# EAGLE design kafka (EAGLE 9.4.1)
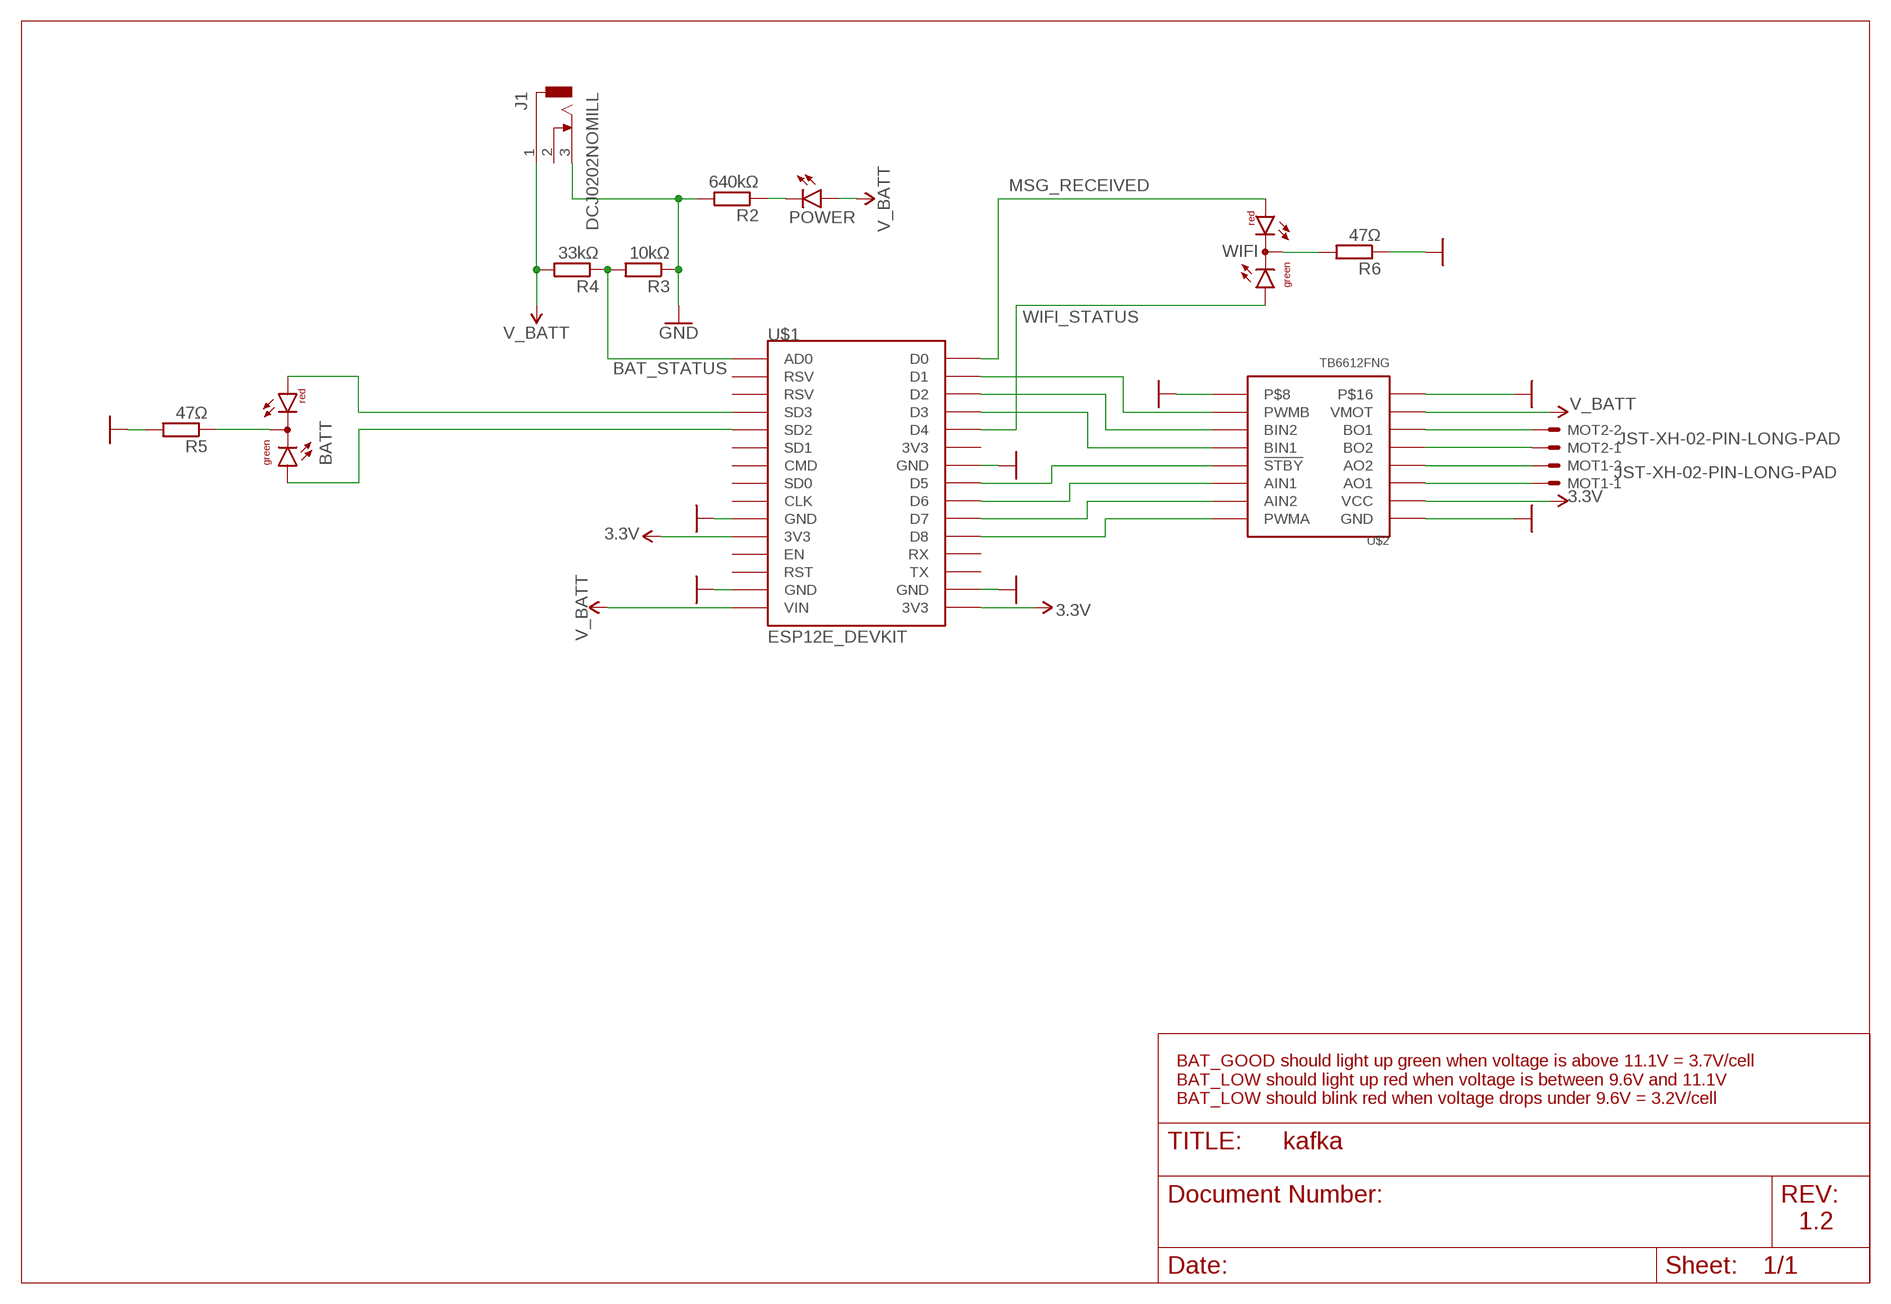
[diagram p0: schematic, sheet 1]

## Parts
BATT  DUOLED-RG-C3MM  [DUOLED-A-3MM]
J1  DCJ0202NOMILL  [DCJ0202_NOMILL]
MOT1  JST-XH-02-PIN-LONG-PAD  [JST-XH-02-PACKAGE-LONG-PAD]
MOT2  JST-XH-02-PIN-LONG-PAD  [JST-XH-02-PACKAGE-LONG-PAD]
POWER  LED3MM  [LED3MM]
R2  640kΩ  R-EU_R0603  [R0603]
R3  10kΩ  R-EU_R0603  [R0603]
R4  33kΩ  R-EU_R0603  [R0603]
R5  47Ω  R-EU_R0603  [R0603]
R6  47Ω  R-EU_R0603  [R0603]
U$1  ESP12E_DEVKIT  [ESP12E_DEVKIT]
U$2  TB6612FNG  [TB6612FNG]
WIFI  DUOLED-RG-C3MM  [DUOLED-A-3MM]

## Nets
3.3V: U$1.3V3@2(3V3) U$2.VCC
AIN1: U$1.D6 U$2.AIN1
AIN2: U$1.D7 U$2.AIN2
BAT_STATUS: R3.2 R4.1 U$1.AD0
BIN1: U$1.D3 U$2.BIN1
BIN2: U$1.D2 U$2.BIN2
GND: J1.3 R2.2 R3.1 R5.2 R6.1 U$1.GND@0(GND) U$1.GND@1(GND) U$1.GND@2(GND) U$1.GND@3(GND) U$2.GND U$2.TB6612FNG1 U$2.TB6612FNG2
MSG_RECEIVED: U$1.D0 WIFI.3(AR)
N$1: MOT2.2 U$2.BO1
N$2: MOT2.1 U$2.BO2
N$3: MOT1.2 U$2.AO2
N$4: MOT1.1 U$2.AO1
N$5: R6.2 WIFI.2(C)
N$11: POWER.K(C) R2.1
N$16: BATT.1(AG) U$1.SD2
N$17: BATT.3(AR) U$1.SD3
N$18: BATT.2(C) R5.1
N$19: U$1.3V3@0(3V3) ; supply symbol labelled 3.3V
PWMA: U$1.D8 U$2.PWMA
PWMB: U$1.D1 U$2.PWMB
STBY: U$1.D5 U$2.!STBY
V_BATT: J1.1 POWER.A R4.2 U$1.VIN U$2.VMOT
WIFI_STATUS: U$1.D4 WIFI.1(AG)
Unconnected: J1.2 U$1.3V3@1(3V3) U$1.CLK U$1.CMD U$1.EN U$1.RST U$1.RSV@0(RSV) U$1.RSV@1(RSV) U$1.RX U$1.SD0 U$1.SD1 U$1.TX

## Notes on the sheet
- BAT_GOOD should light up green when voltage is above 11.1V = 3.7V/cell
  BAT_LOW should light up red when voltage is between 9.6V and 11.1V
  BAT_LOW should blink red when voltage drops under 9.6V = 3.2V/cell
- 1.2

## Library data of the parts
BATT WIFI = led2:DUOLED-RG-C: DUO LED 2 colors (red/green), 5 mm, round, common Cathode www.ligitek.com or other producers.
J1 = con-jack:DCJ0202: DC POWER JACK Source: DCJ0202.pdf
MOT1 MOT2 = Rembrandt Electronics - JST XH Connectors v1-0:JST-XH-02-PIN: JST XH Connector 2 Pin Wire to board connector. Pitch: 2,54 mm, (0.100") Number of pins: 2 Created by Rembrandt Electronics www.rembrandtelectronics.com
POWER = led:LED: LED OSRAM: - CHIPLED LG R971, LG N971, LY N971, LG Q971, LY Q971, LO R971, LY R971 LH N974, LH R974 LS Q976, LO Q976, LY Q976 LO Q996 - Hyper CHIPLED LW Q18S LB Q993, LB Q99A, LB R99A - SideLED LS A670, LO A670, LY A670, LG A670, LP A670 LB A673, LV A673, LT A673, LW A673 LH A674 LY A675 LS A676, LA A676, LO A676, LY A676, LW A676 LS A679, LY A679, LG A679 - Hyper Micro SIDELED® LS Y876, LA Y876, LO Y876, LY Y876 LT Y87S - SmartLED LW L88C, LW L88S LB L89C, LB L89S, LG L890 LS L89K, LO L89K, LY L89K LS L896, LA L896, LO L896, LY L896 - TOPLED LS T670, LO T670, LY T670, LG T670, LP T670 LSG T670, LSP T670, LSY T670, LOP T670, LYG T670 LG T671, LOG T671, LSG T671 LB T673, LV T673, LT T673, LW T673 LH T674 LS T676, LA T676, LO T676, LY T676, LB T676, LH T676, LSB T676, LW T676 LB T67C, LV T67C, LT T67C, LS T67K, LO T67K, LY T67K, LW E67C LS E67B, LA E67B, LO E67B, LY E67B, LB E67C, LV E67C, LT E67C LW T67C LS T679, LY T679, LG T679 LS T770, LO T770, LY T770, LG T770, LP T770 LB T773, LV T773, LT T773, LW T773 LH T774 LS E675, LA E675, LY E675, LS T675 LS T776, LA T776, LO T776, LY T776, LB T776 LHGB T686 LT T68C, LB T68C - Hyper Mini TOPLED® LB M676 - Mini TOPLED Santana® LG M470 LS M47K, LO M47K, LY M47K Source: http://www.osram.convergy.de LUXEON: - LUMILED® LXK2-PW12-R00, LXK2-PW12-S00, LXK2-PW14-U00, LXK2-PW14-V00 LXK2-PM12-R00, LXK2-PM12-S00, LXK2-PM14-U00 LXK2-PE12-Q00, LXK2-PE12-R00, LXK2-PE12-S00, LXK2-PE14-T00, LXK2-PE14-U00 LXK2-PB12-K00, LXK2-PB12-L00, LXK2-PB12-M00, LXK2-PB14-N00, LXK2-PB14-P00, LXK2-PB14-Q00 LXK2-PR12-L00, LXK2-PR12-M00, LXK2-PR14-Q00, LXK2-PR14-R00 LXK2-PD12-Q00, LXK2-PD12-R00, LXK2-PD12-S00 LXK2-PH12-R00, LXK2-PH12-S00 LXK2-PL12-P00, LXK2-PL12-Q00, LXK2-PL12-R00 Source: www.luxeon.com KINGBRIGHT: KA-3528ASYC Source: www.kingbright.com
R2-R6 = rcl:R-EU_: RESISTOR, European symbol; SPICEPREFIX: R
U$1 = ESP12E_DEVKIT:ESP12E_DEVKIT: ESP12E DEVKIT BOARD
U$2 = Pololu_JJ:TB6612FNG: Pololu TB6612FNG Dual Motor Driver Carrier https://www.pololu.com/product/713

## Board
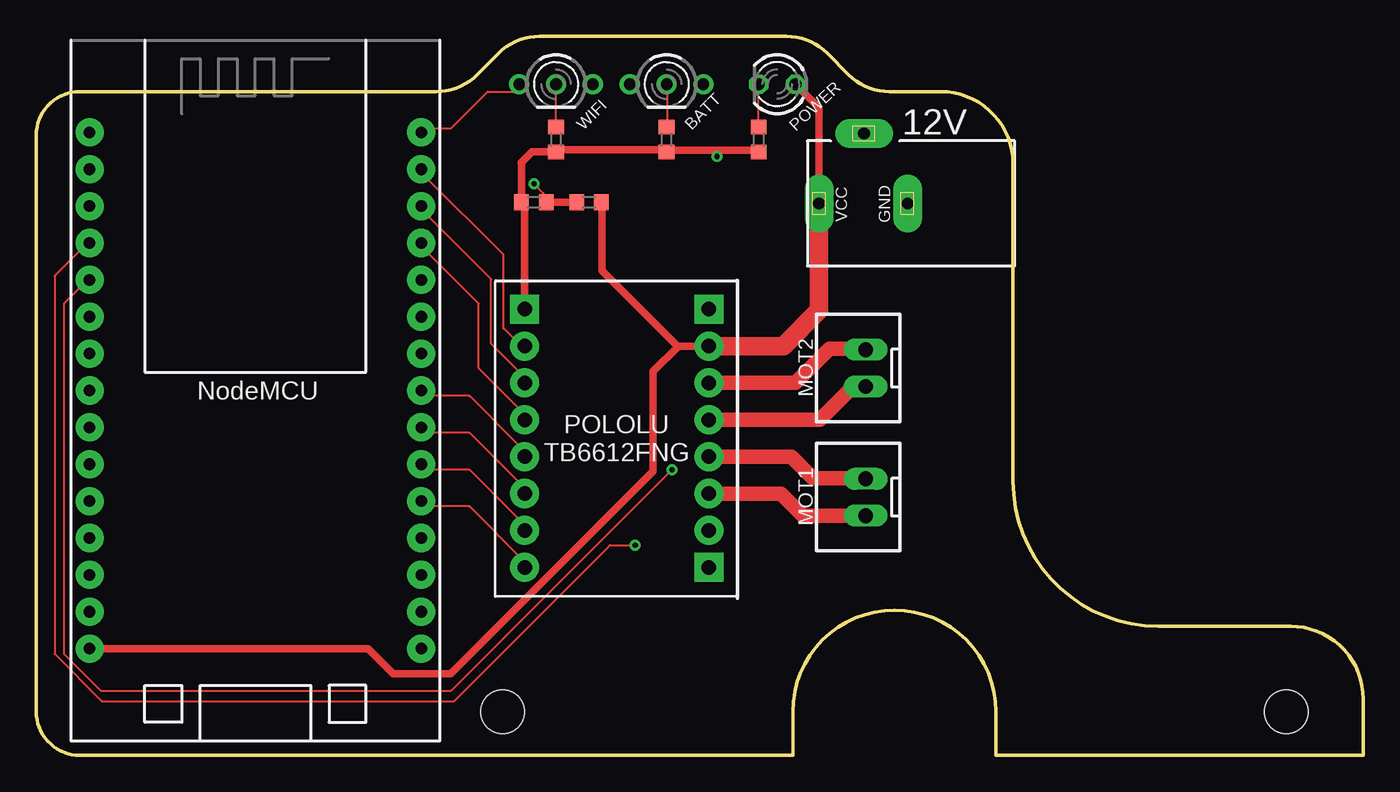
[diagram p1: board, top side]
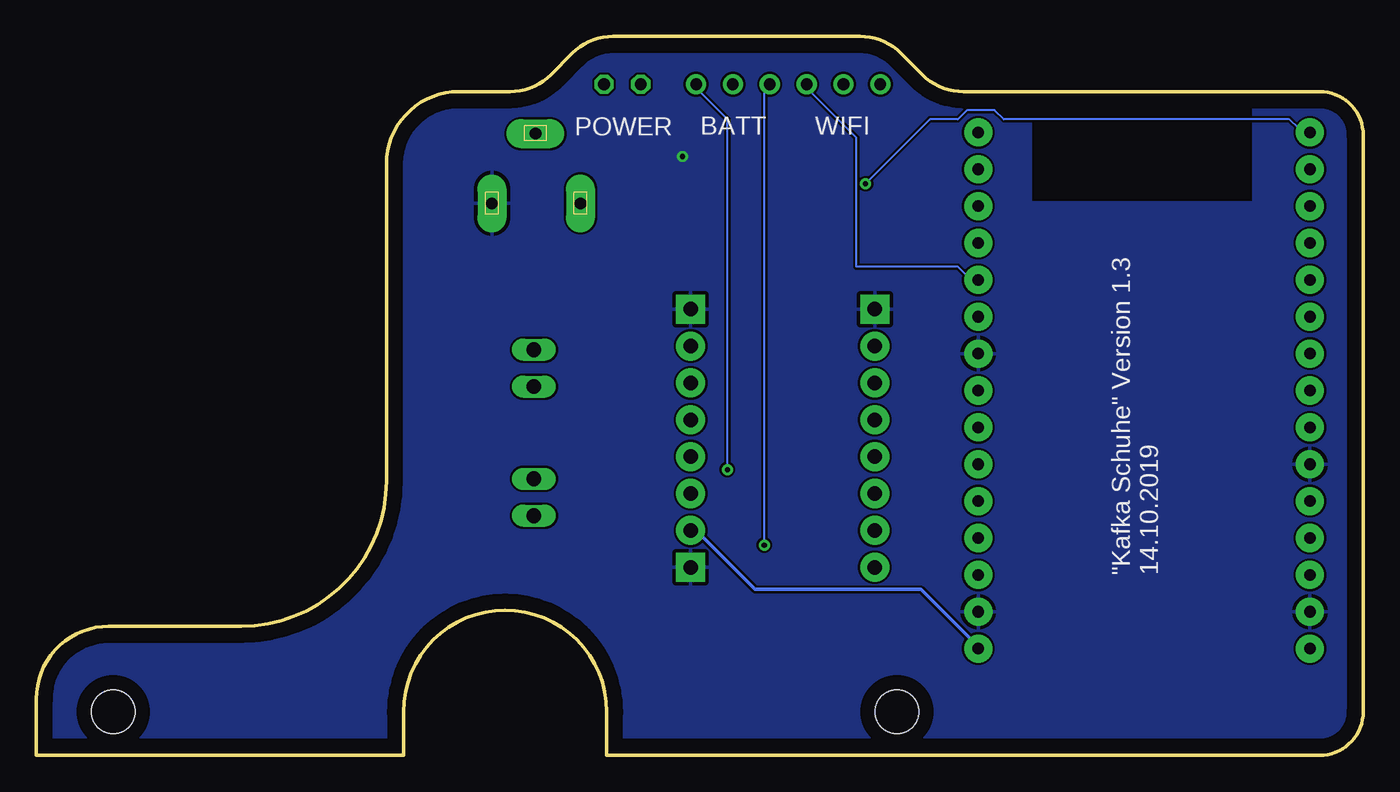
[diagram p2: board, bottom side, seen from below]

Size 91.44 x 49.53 mm. Coordinates in mm from the lower left corner, seen from the top.
Outline: 67.31,18.89 67.31,40.72 arc90 62.31,45.72 58.81,45.72 arc-45 55.98,46.89 54.51,48.36 arc45 51.68,49.53 34.68,49.53 arc45 31.85,48.36 30.38,46.89 arc-45 27.55,45.72 3,45.72 arc90 0,42.72 0,3 arc90 3,0 52.13,0 52.13,3 arc-180 66.13,3 66.13,0 91.44,0 91.44,3.89 arc90 86.44,8.89 77.31,8.89 arc-90 67.31,18.89
Copper layers (1*16): Top 0.035mm / dielectric 1.5mm / Bottom 0.035mm
Design rules "default": minimum track width 6mil, minimum drill 0.35mm, track to track 6mil, track to pad 6mil, pad to pad 6mil, via to via 6mil, smd to smd 6mil, copper to edge 40mil, drill to drill 6mil, minimum pad ring 10mil, minimum via ring 8mil, stop-mask expansion 4mil, vias tented up to drill 0mil, thermal gap 10mil
Holes 3 mm at 86.13,3 32.13,3

### Footprints (pad centres in the part's own frame; a part is rotated, then mirrored left to right if it is on the bottom)
DUOLED-A-3MM = drill 0.8 pad 1.4: 1 -2.54,0; 2 0,0; 3 2.54,0
DCJ0202_NOMILL = drill 0.8 pad 2 long: 1 0,3.1; 2 4.8,0; 3 0,-3
JST-XH-02-PACKAGE-LONG-PAD = drill 1.016 long: 1 -1.27,0; 2 1.27,0
LED3MM = drill 0.813 octagon: A -1.27,0; K 1.27,0
R0603 = smd 1 x 1.1: 1 -0.85,0; 2 0.85,0
ESP12E_DEVKIT = drill 0.8 pad 1.93: 3V3@0 -11.43,-7.62; 3V3@1 11.43,5.08; 3V3@2 11.43,-17.78; AD0 -11.43,17.78; CLK -11.43,-2.54; CMD -11.43,2.54; D0 11.43,17.78; D1 11.43,15.24; D2 11.43,12.7; D3 11.43,10.16; D4 11.43,7.62; D5 11.43,0; D6 11.43,-2.54; D7 11.43,-5.08; D8 11.43,-7.62; EN -11.43,-10.16; GND@0 -11.43,-5.08; GND@1 -11.43,-15.24; GND@2 11.43,2.54; GND@3 11.43,-15.24; RST -11.43,-12.7; RSV@0 -11.43,15.24; RSV@1 -11.43,12.7; RX 11.43,-10.16; SD0 -11.43,0; SD1 -11.43,5.08; SD2 -11.43,7.62; SD3 -11.43,10.16; TX 11.43,-12.7; VIN -11.43,-17.78
TB6612FNG = drill 1 pad 2: !STBY 12.7,-7.62; AIN1 12.7,-5.08; AIN2 12.7,-2.54; AO1 0,-5.08; AO2 0,-7.62; BIN1 12.7,-10.16; BIN2 12.7,-12.7; BO1 0,-12.7; BO2 0,-10.16; PWMA 12.7,0; PWMB 12.7,-15.24; VCC 0,-2.54; VMOT 0,-15.24 | drill 1 pad 2 square: GND 0,0; TB6612FNG1 0,-17.78; TB6612FNG2 12.7,-17.78

### Placement (x,y rotation side)
BATT  43.43,46.23 180 top
J1  57.04,38.02 90 top
MOT1  57.15,17.78 90 top
MOT2  57.15,26.67 90 top
POWER  51.05,46.23 180 top
R2  49.78,42.42 270 top
R3  34.29,38.1 0 top
R4  38.1,38.1 0 top
R5  43.43,42.42 270 top
R6  35.81,42.42 90 top
U$1  15.1,25.13 0 top
U$2  46.36,12.95 180 top
WIFI  35.81,46.23 180 top

### Tracks (layer width: path | path; a pad name or v marks a point on that pad's centre or on a via)
3.3V
  Bottom 0.152: 45.72,15.24 46.36,15.24 U$2.VCC | 26.67,7.62 U$1.3V3@2
  Bottom 0.254: 26.67,7.62 30.48,11.43 41.91,11.43 45.72,15.24
AIN1
  Top 0.152: U$1.D6 26.67,22.23 29.84,22.23 33.66,18.41 U$2.AIN1
AIN2
  Top 0.152: U$1.D7 26.67,19.68 29.84,19.68 33.66,15.88 U$2.AIN2
BAT_STATUS  (via drill 0.35)
  Top 0.152: v34.29,39.37 34.92,38.73 34.92,38.1 R3.2
  Top 0.508: R3.2 R4.1
  Bottom 0.152: v34.29,39.37 29.84,43.81 27.94,43.81 27.3,44.45 25.4,44.45 24.77,43.81 5.08,43.81 4.45,43.18 3.81,43.18 U$1.AD0
BIN1
  Top 0.152: U$1.D3 26.67,34.92 30.48,31.11 30.48,26.67 33.66,23.5 U$2.BIN1
BIN2
  Top 0.152: U$1.D2 26.67,37.47 31.35,32.78 31.35,28.34 33.66,26.04 U$2.BIN2
GND  (via drill 0.35)
  Top 0.152: 33.66,37.72 33.66,38.1 R3.1 | 36.2,41.91 R6.1 35.56,41.91 | 43.18,41.91 R5.2 43.6,41.72 | 49.53,41.91 49.71,41.66 R2.2
  Top 0.508: U$2.TB6612FNG2 33.66,37.72 | R3.1 33.44,40.79 33.42,40.81 34.18,41.57 R6.1 35.96,41.72 43.6,41.72 | R5.2 43.53,41.66 49.71,41.66
  other vias: 46.91,41.25
  pour Bottom: 0,0 0,45.72 7.62,45.72 7.62,38.1 22.86,38.1 22.86,45.72 29.21,45.72 29.21,49.53 57.15,49.53 57.15,45.72 67.31,45.72 67.31,17.78 76.2,17.78 76.2,8.89 91.44,8.89 91.44,-1.27 0,-1.27
MSG_RECEIVED
  Top 0.152: WIFI.3 33.02,45.72 31.11,45.72 28.57,43.18 26.67,43.18 U$1.D0
N$1
  Top 1.016: U$2.BO1 52.31,25.65 54.67,28.01 57.08,28.01 MOT2.2
N$2
  Top 1.016: U$2.BO2 54.01,23.11 56.11,25.21 56.11,25.35 56.16,25.4 MOT2.1
N$3
  Top 1.016: MOT1.2 57.15,19.08 53.52,19.08 52.03,20.57 U$2.AO2
N$4
  Top 1.016: U$2.AO1 51.3,18.03 52.83,16.51 MOT1.1
N$5
  Top 0.152: R6.2 WIFI.2
N$11
  Top 0.152: R2.1 POWER.K
N$16  (via drill 0.35)
  Top 0.152: v43.81,19.68 28.57,4.45 4.45,4.45 1.9,6.99 1.9,31.11 3.18,32.38 U$1.SD2
  Bottom 0.152: v43.81,19.68 43.81,43.81 45.72,45.72 BATT.1
N$17  (via drill 0.35)
  Top 0.152: v41.27,14.47 39.52,14.47 28.78,3.73 4.52,3.73 1.27,6.99 1.27,33.02 3.18,34.92 U$1.SD3
  Bottom 0.152: v41.27,14.47 41.27,45.72 BATT.3
N$18
  Top 0.152: R5.1 43.47,43.26 43.47,46.19 BATT.2
PWMA
  Top 0.152: U$1.D8 26.67,17.14 29.84,17.14 33.66,13.34 U$2.PWMA
PWMB
  Top 0.152: U$1.D1 26.67,40.01 32.19,34.49 32.19,29.41 33.66,27.94 U$2.PWMB
STBY
  Top 0.152: U$1.D5 26.67,24.77 29.84,24.77 33.66,20.95 U$2.!STBY
V_BATT
  Top 0.152: 39,38.1 R4.2
  Top 0.508: U$1.VIN 22.86,7.35 24.59,5.62 28.56,5.62 42.51,19.57 42.51,26.45 44.25,28.19 U$2.VMOT 44.17,28.19 39,33.36 39,38.1 | POWER.A 53.94,44.62 J1.1
  Top 1.27: U$2.VMOT 51.48,28.19 53.94,30.65 J1.1
WIFI_STATUS
  Bottom 0.152: WIFI.1 38.1,45.72 34.92,42.55 34.92,33.66 27.94,33.66 27.3,33.02 26.67,33.02 U$1.D4

### Text on the board
tNames: WIFI | BATT | POWER | 12V | NodeMCU
bNames: "Kafka Schuhe" Version 1.3 / 14.10.2019